# Altium schematic sheet DWS_Main_Board.SchDoc
size A3
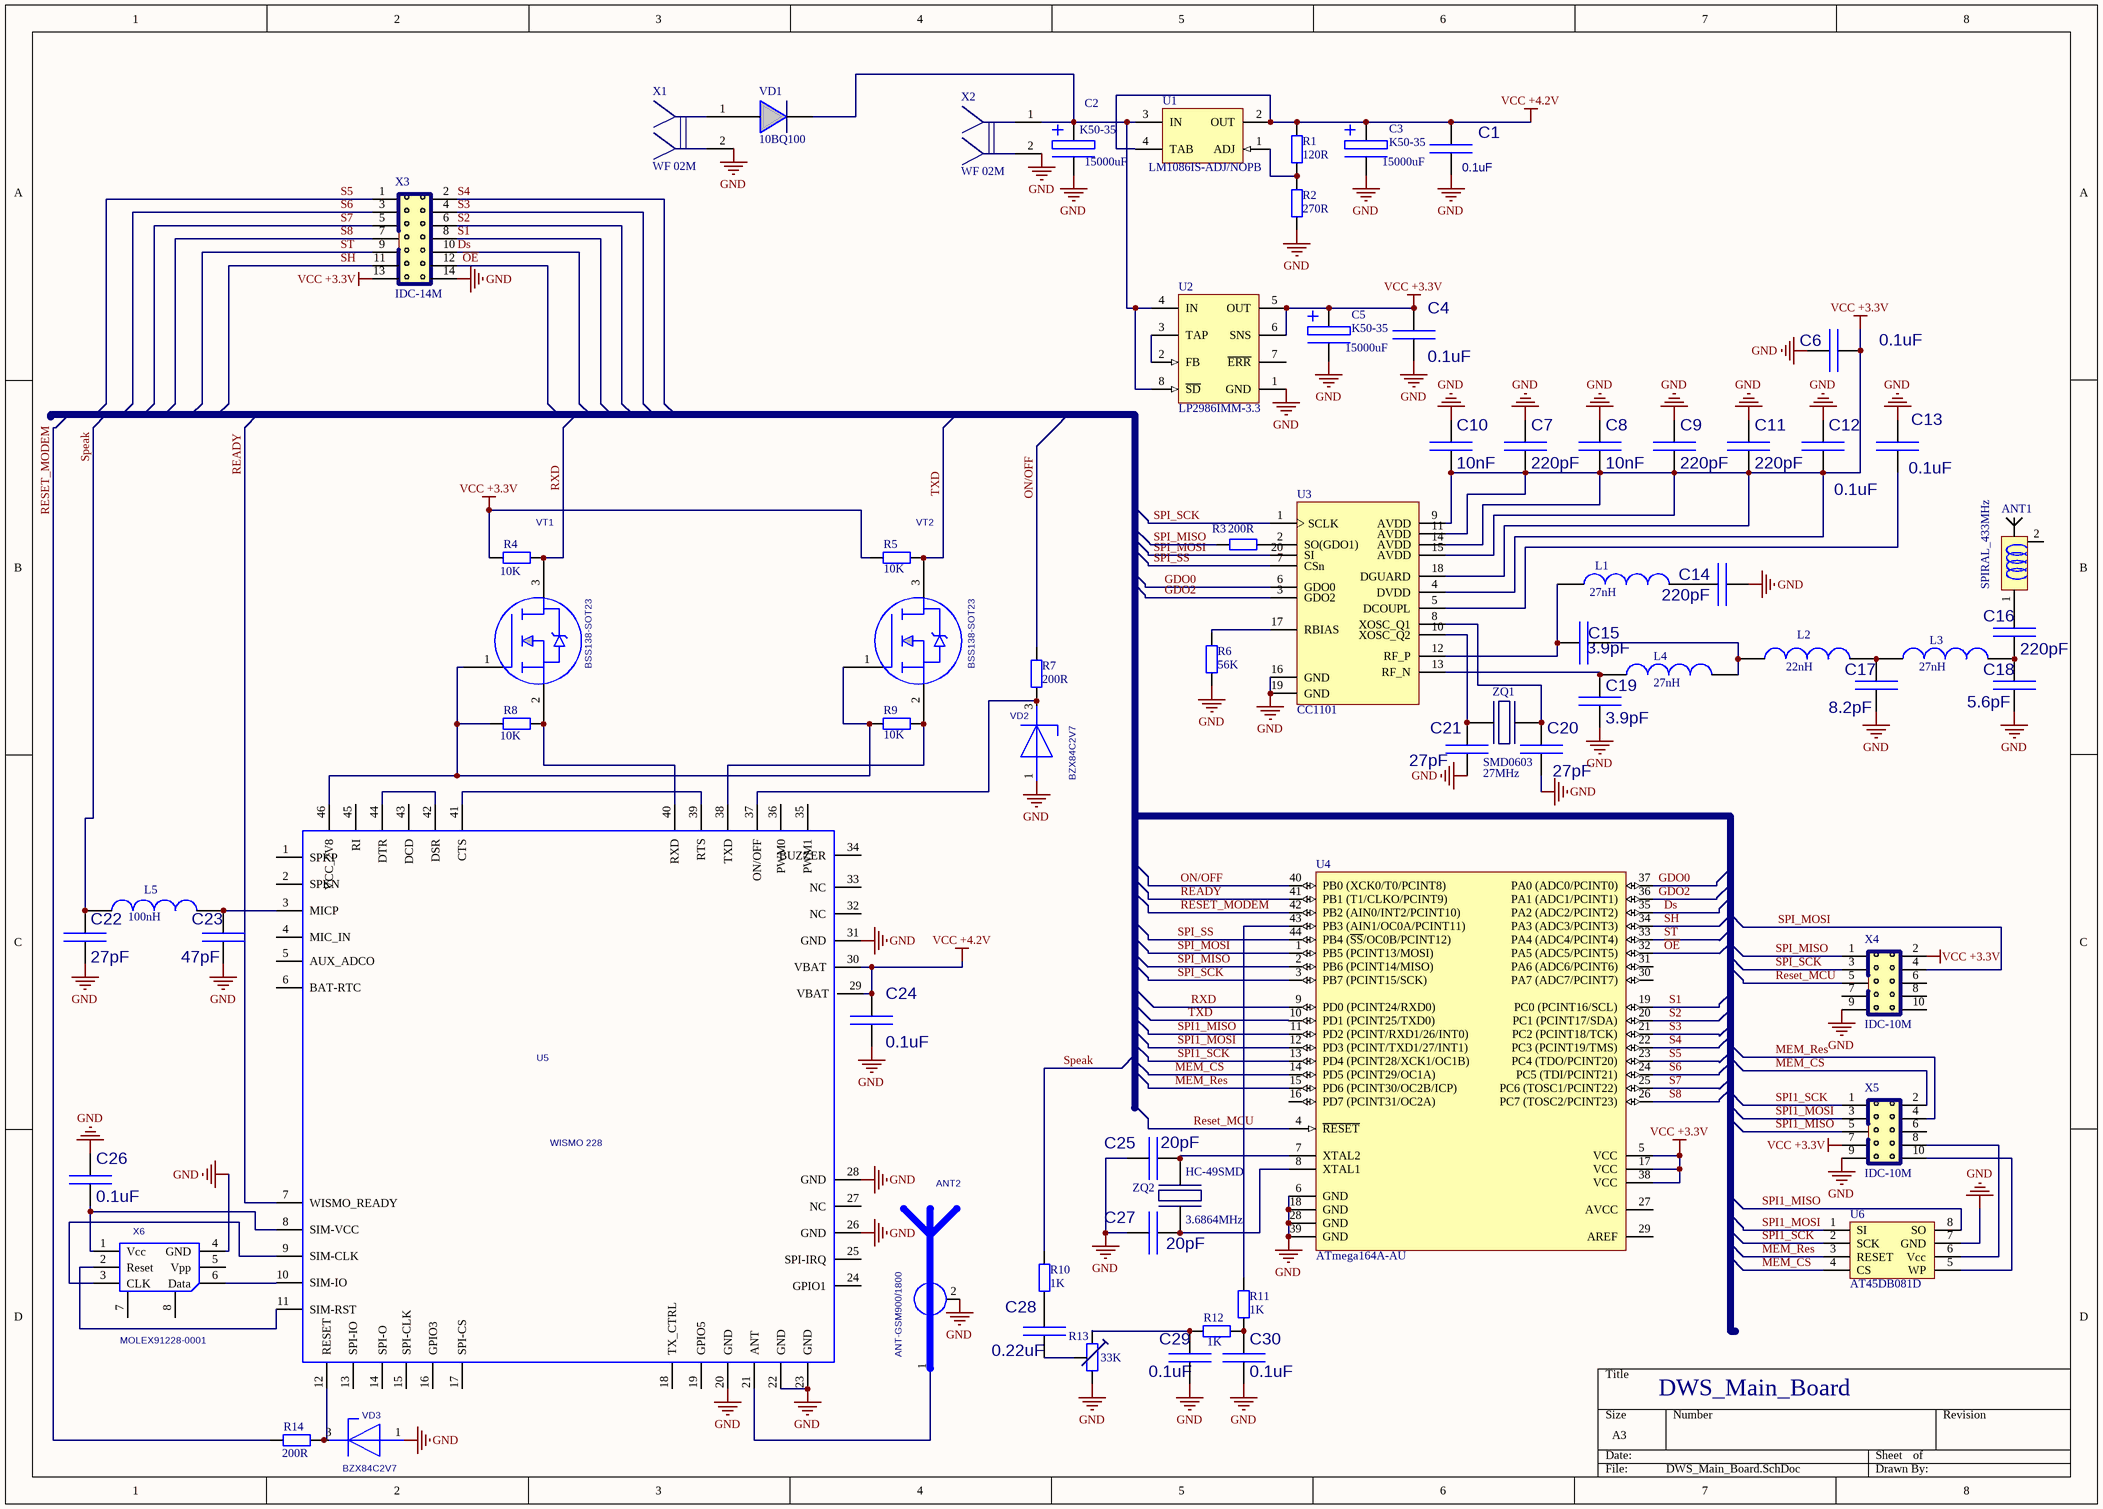
[diagram p0: DWS_Main_Board.SchDoc]

## Parts
ANT1  SPIRAL_433MHz  [ANT_433MHz_SPIRAL]
ANT2  ANT-GSM900/1800  [ANT-GSM]
C1  value 0.1uF  [C0805]  (hidden comment: KONDENS_SMD)
C2  K50-35  [CAP_POL_D18-Horizontal]
C3  K50-35  [CAP_POL_D18-Horizontal]
C4  value 0.1uF  [C0805]  (hidden comment: KONDENS_SMD)
C5  K50-35  [CAP_POL_D18-Horizontal]
C6  value 0.1uF  [C0805]  (hidden comment: KONDENS_SMD)
C7  value 220pF  [C0805]  (hidden comment: KONDENS_SMD)
C8  value 10nF  [C0805]  (hidden comment: KONDENS_SMD)
C9  value 220pF  [C0805]  (hidden comment: KONDENS_SMD)
C10  value 10nF  [C0805]  (hidden comment: KONDENS_SMD)
C11  value 220pF  [C0805]  (hidden comment: KONDENS_SMD)
C12  value 0.1uF  [C0805]  (hidden comment: KONDENS_SMD)
C13  value 0.1uF  [C0805]  (hidden comment: KONDENS_SMD)
C14  value 220pF  [C0805]  (hidden comment: KONDENS_SMD)
C15  value 3.9pF  [C0805]  (hidden comment: KONDENS_SMD)
C16  value 220pF  [C0805]  (hidden comment: KONDENS_SMD)
C17  value 8.2pF  [C0805]  (hidden comment: KONDENS_SMD)
C18  value 5.6pF  [C0805]  (hidden comment: KONDENS_SMD)
C19  value 3.9pF  [C0805]  (hidden comment: KONDENS_SMD)
C20  value 27pF  [C0805]  (hidden comment: KONDENS_SMD)
C21  value 27pF  [C0805]  (hidden comment: KONDENS_SMD)
C22  value 27pF  [C0805]  (hidden comment: KONDENS_SMD)
C23  value 47pF  [C0805]  (hidden comment: KONDENS_SMD)
C24  value 0.1uF  [C0805]  (hidden comment: KONDENS_SMD)
C25  value 20pF  [C0805]  (hidden comment: KONDENS_SMD)
C26  value 0.1uF  [C0805]  (hidden comment: KONDENS_SMD)
C27  value 20pF  [C0805]  (hidden comment: KONDENS_SMD)
C28  value 0.22uF  [C0805]  (hidden comment: KONDENS_SMD)
C29  value 0.1uF  [C0805]  (hidden comment: KONDENS_SMD)
C30  value 0.1uF  [C0805]  (hidden comment: KONDENS_SMD)
L1  value 27nH  [6-0805_M]  (hidden comment: SMD_0805)
L2  value 22nH  [6-0805_M]  (hidden comment: SMD_0805)
L3  value 27nH  [6-0805_M]  (hidden comment: SMD_0805)
L4  value 27nH  [6-0805_M]  (hidden comment: SMD_0805)
L5  value 100nH  [6-0805_M]  (hidden comment: SMD_0805)
R1  value 120R  [C0805]  (hidden comment: RES)
R2  value 270R  [C0805]  (hidden comment: RES)
R3  value 200R  [C0805]  (hidden comment: RES)
R4  value 10K  [C0805]  (hidden comment: RES)
R5  value 10K  [C0805]  (hidden comment: RES)
R6  value 56K  [C0805]  (hidden comment: RES)
R7  value 200R  [C0805]  (hidden comment: RES)
R8  value 10K  [C0805]  (hidden comment: RES)
R9  value 10K  [C0805]  (hidden comment: RES)
R10  value 1K  [C0805]  (hidden comment: RES)
R11  value 1K  [C0805]  (hidden comment: RES)
R12  value 1K  [C0805]  (hidden comment: RES)
R13  value 33K  [CA6V]  (hidden comment: CA6V)
R14  value 200R  [C0805]  (hidden comment: RES)
U1  LM1086IS-ADJ/NOPB  [TS3B_M]
U2  LP2986IMM-3.3  [MUA08A_M]
U3  CC1101  [VQFN20]
U4  ATmega164A-AU  [44A_M]
U5  WISMO 228  [WISMO]
U6  AT45DB081D  [SOIC-8]
VD1  10BQ100  [SMB]
VD2  BZX84C2V7  [SOT23]
VD3  BZX84C2V7  [SOT23]
VT1  BSS138-SOT23  [SOT23]
VT2  BSS138-SOT23  [SOT23]
X1  WF 02M  [WF 02M]
X2  WF 02M  [WF 02M]
X3  IDC-14M  [IDC-14M]
X4  IDC-10M  [IDC-10M]
X5  IDC-10M  [IDC-10M]
X6  MOLEX91228-0001  [MOLEX91228-0001]
ZQ1  SMD0603  value 27MHz  [Quartz_SMD0603]
ZQ2  HC-49SMD  value 3.6864MHz  [HC-49SMD]

## Nets
GND: ANT2.2 C1.2(B) C2.2(MINUS) C3.2(MINUS) C4.2(B) C5.2(MINUS) C6.1(A) C7.1(A) C8.1(A) C9.1(A) C10.1(A) C11.1(A) C12.1(A) C13.1(A) C14.2(B) C17.2(B) C18.2(B) C19.2(B) C20.2(B) C21.2(B) C22.2(B) C23.2(B) C24.2(B) C25.1(A) C26.1(A) C27.1(A) C29.2(B) C30.2(B) R2.1 R6.1 R13.2 U2.1(GND) U3.16(GND) U3.19(GND) U4.6(GND) U4.18(GND) U4.28(GND) U4.39(GND) U5.20(GND) U5.22(GND) U5.23(GND) U5.26(GND) U5.28(GND) U5.31(GND) U6.7(GND) VD2.1 VD3.1 X1.2 X2.2 X3.14 X4.9 X5.9 X6.4(GND)
VCC +3.3V: C4.1(A) C5.1(PLUS) C6.2(B) C7.2(B) C8.2(B) C9.2(B) C10.2(B) C11.2(B) C12.2(B) R4.1 R5.1 U2.5(OUT) U2.6(SNS) U3.4(DVDD) U3.9(AVDD) U3.11(AVDD) U3.14(AVDD) U3.15(AVDD) U3.18(DGUARD) U4.5(VCC) U4.17(VCC) U4.38(VCC) X3.13 X4.2 X5.7
VCC +4.2V: C1.1(A) C3.1(PLUS) C24.1(A) R1.2 U1.2(OUT) U1.4(TAB) U5.29(VBAT) U5.30(VBAT)
Ds: U4.35(PA2_(ADC2/PCINT2)) X3.10
GDO0: U3.6(GDO0) U4.37(PA0_(ADC0/PCINT0))
GDO2: U3.3(GDO2) U4.36(PA1_(ADC1/PCINT1))
MEM_CS: U4.14(PD5_(PCINT29/OC1A)) U6.4(CS) X5.2
MEM_Res: U4.15(PD6_(PCINT30/OC2B/ICP)) U6.3(RESET) X5.4
~{OE}: U4.32(PA5_(ADC5/PCINT5)) X3.12
ON/OFF: R7.2 U4.40(PB0_(XCK0/T0/PCINT8))
READY: U4.41(PB1_(T1/CLKO/PCINT9)) U5.7(WISMO_READY)
Reset_MCU: U4.4(~{RESET}) X4.5
RESET_MODEM: R14.1 U4.42(PB2_(AIN0/INT2/PCINT10))
RXD: R4.2 U4.9(PD0_(PCINT24/RXD0)) VT1.3(Drain)
S1: U4.19(PC0_(PCINT16/SCL)) X3.8
S2: U4.20(PC1_(PCINT17/SDA)) X3.6
S3: U4.21(PC2_(PCINT18/TCK)) X3.4
S4: U4.22(PC3_(PCINT19/TMS)) X3.2
S5: U4.23(PC4_(TDO/PCINT20)) X3.1
S6: U4.24(PC5_(TDI/PCINT21)) X3.3
S7: U4.25(PC6_(TOSC1/PCINT22)) X3.5
S8: U4.26(PC7_(TOSC2/PCINT23)) X3.7
SH: U4.34(PA3_(ADC3/PCINT3)) X3.11
Speak: C22.1(A) L5.1 R10.2
SPI1_MISO: U4.11(PD2_(PCINT/RXD1/26/INT0)) U6.8(SO) X5.5
SPI1_MOSI: U4.12(PD3_(PCINT/TXD1/27/INT1)) U6.1(SI) X5.3
SPI1_SCK: U4.13(PD4_(PCINT28/XCK1/OC1B)) U6.2(SCK) X5.1
SPI_MISO: R3.1 U4.2(PB6_(PCINT14/MISO)) X4.1
SPI_MOSI: U3.20(SI) U4.1(PB5_(PCINT13/MOSI)) X4.4
SPI_SCK: U3.1(SCLK) U4.3(PB7_(PCINT15/SCK)) X4.3
SPI_SS: U3.7(CSn) U4.44(PB4_(~{SS}/OC0B/PCINT12))
ST: U4.33(PA4_(ADC4/PCINT4)) X3.9
TXD: R5.2 U4.10(PD1_(PCINT25/TXD0)) VT2.3(Drain)
NetANT1_1: ANT1.1 C16.1(A)
NetANT2_1: ANT2.1 U5.21(ANT)
NetC2_1: C2.1(PLUS) U1.3(IN) U2.4(IN) U2.8(~{SD}) VD1.1 X2.1
NetC13_2: C13.2(B) U3.5(DCOUPL)
NetC14_1: C14.1(A) L1.2
NetC15_1: C15.1(A) L1.1 U3.12(RF_P)
NetC15_2: C15.2(B) L2.1 L4.2
NetC16_2: C16.2(B) C18.1(A) L3.2
NetC17_1: C17.1(A) L2.2 L3.1
NetC19_1: C19.1(A) L4.1 U3.13(RF_N)
NetC20_1: C20.1(A) U3.8(XOSC_Q1) ZQ1.1
NetC21_1: C21.1(A) U3.10(XOSC_Q2) ZQ1.3
NetC23_1: C23.1(A) L5.2 U5.3(MICP)
NetC25_2: C25.2(B) U4.7(XTAL2) ZQ2.1
NetC26_2: C26.2(B) U5.8(SIM-VCC) X6.1(Vcc)
NetC27_2: C27.2(B) U4.8(XTAL1) ZQ2.2
NetC28_1: C28.1(A) R10.1
NetC28_2: C28.2(B) R13.3
NetC29_1: C29.1(A) R12.2 R13.1
NetC30_1: C30.1(A) R11.1 R12.1
NetR1_1: R1.1 R2.2 U1.1(ADJ)
NetR3_2: R3.2 U3.2(SO(GDO1))
NetR6_2: R6.2 U3.17(RBIAS)
NetR7_1: R7.1 U5.37(ON/OFF) VD2.3
NetR8_1: R8.1 R9.1 U5.46(VCC_2V8) VT1.1(Gate) VT2.1(Gate)
NetR8_2: R8.2 U5.40(RXD) VT1.2(Source)
NetR9_2: R9.2 U5.38(TXD) VT2.2(Source)
NetR11_2: R11.2 U4.43(PB3_(AIN1/OC0A/PCINT11))
NetR14_2: R14.2 U5.12(RESET) VD3.3
NetU2_2: U2.2(FB) U2.3(TAP)
NetU5_9: U5.9(SIM-CLK) X6.3(CLK)
NetU5_10: U5.10(SIM-IO) X6.6(Data)
NetU5_11: U5.11(SIM-RST) X6.2(Reset)
NetU5_39: U5.39(RTS) U5.41(CTS)
NetU5_42: U5.42(DSR) U5.44(DTR)
NetU6_5: U6.5(WP) X5.10
NetU6_6: U6.6(Vcc) X5.8
NetVD1_2: VD1.2 X1.1

Not connected (* = marked no-connect by the designer): ANT1 2; U2 7(~{ERR}); U4 16(PD7_(PCINT31/OC2A)) 27(AVCC) 29(AREF) 30(PA7_(ADC7/PCINT7)) 31(PA6_(ADC6/PCINT6)); U5 1(SPKP) 2(SPKN) 4(MIC_IN) 5(AUX_ADCO) 6(BAT-RTC) 13(SPI-IO) 14(SPI-O) 15(SPI-CLK) 16(GPIO3) 17(SPI-CS) 18(TX_CTRL) 19(GPIO5) 24(GPIO1) 25(SPI-IRQ) 27(NC) 32(NC) 33(NC) 34(BUZZER) 35(PWM1) 36(PWM0) 43(DCD) 45(RI); VD2 2; VD3 2; X4 6 7 8 10; X5 6; X6 5(Vpp) 7(0) 8(1)

## Notes on the sheet
- DWS_Main_Board
- (in symbol Capasitor _pol D18) 15000uF

## Library data of the parts
ANT1 = ANT_433MHz_SPIRAL
C2 C3 C5 = Capasitor _pol D18
L1-L5 = Induktor_0805
R1-R12 R14 = RES: Resistor
R13 = Resistor_podstr
U1 = LM1086IS-ADJ/NOPB: 1.5A Low Dropout Positive Regulators, 3-pin TO-263, Pb-Free; Manufacturer: National Semiconductor; PackageTopMarking: NSUZXYTTE#*LM1086*IS-ADJ; PowerWise: N; CompType: LDO IC; Published: 1-Mar-2010; DatasheetVersion: Jun-2005; PackageVersion: revF, Apr-2005; PackageReference: TS3B; Publisher: Altium Limited; PackageDescription: TO-263, Molded, .400 x .390 x .180in, 3 Lead, .1in Pitch, Surface Mount; Supplier 1: Digi-Key; Supplier Part Number 1: LM1086IS-ADJ-ND; Supplier 2: Farnell; Supplier Part Number 2: 1469045; PartNumber: LM1086IS-ADJ/NOPB; RoHS: Y; PinCount: 3; Code_JEDEC: MO-169-AA; ComponentLink1Description: LM1086 Datasheet; ComponentLink1URL: http://www.national.com/ds/LM/LM1086.pdf; ComponentLink2Description: LM1086 Web Page; ComponentLink2URL: http://www.national.com/pf/LM/LM1086.html; ComponentLink3Description: TS3B Package Page; ComponentLink3URL: http://www.national.com/packaging/folders/ts3b.html
U2 = LP2986IMM-3.3: Micropower, 200 mA Ultra Low-Dropout Fixed or Adjustable Voltage Regulator, 8-pin Mini SOIC; Manufacturer: National Semiconductor; PackageTopMarking: ZXTT*L40B; PowerWise: N; CompType: LDO IC; Published: 4-Dec-2008; DatasheetVersion: Mar-2005; PackageVersion: revF, Apr-2008; PackageReference: MUA08A; Publisher: Altium Limited; PackageDescription: MINI SOIC, .118 x .118 x .034in, 8 Lead, .0256in Pitch; Supplier 1: Farnell; Supplier Part Number 1: 956338; PartNumber: LP2986IMM-3.3; RoHS: N; PinCount: 8; Code_JEDEC: MO-187-AA; ComponentLink1Description: LP2986 Datasheet; ComponentLink1URL: http://www.national.com/ds/LP/LP2986.pdf; ComponentLink2Description: LP2986 Web Page; ComponentLink2URL: http://www.national.com/pf/LP/LP2986.html; ComponentLink3Description: MUA08A Package Page; ComponentLink3URL: http://www.national.com/packaging/folders/mua08a.html
U4 = ATmega164A-AU: 8-bit AVR Microcontroller, 16KB Flash, 512 Bytes EEPROM, 1KB SRAM, 44-pin TQFP, Industrial Grade (-40°C to 85°C); Published: 1-Apr-2010; DatasheetVersion: revA, Jan-2010; PackageVersion: rev.B, Oct-2001; PackageReference: 44A; Publisher: Altium Limited; PackageDescription: 44-Pin Plastic Thin Profile Quad Flat Pack, 10 x 10 x 1.0 mm Body, 0.8 mm Pitch (TQFP); Supplier 1: Digi-Key; Supplier Part Number 1: ATMEGA164A-AU-ND; Supplier 2: Mouser; Supplier Part Number 2: 556-ATMEGA164A-AU; ComponentLink1Description: Manufacturer Link; ComponentLink1URL: http://www.atmel.com/products/avr/default.asp?; ComponentLink2Description: ATmega164A/164PA/324A/324PA/644A/644PA/1284/1284P Datasheet; ComponentLink2URL: http://www.atmel.com/dyn/resources/prod_documents/doc8272.pdf; ComponentLink3Description: ATmega164A/164PA/324A/324PA/644A/644PA/1284/1284P Summary; ComponentLink3URL: http://www.atmel.com/dyn/resources/prod_documents/8272S.pdf; ComponentLink4Description: Atmel.com Home; ComponentLink4URL: http://www.atmel.com
ZQ1 = Quartz_SMD0603
ANT2 = ANT-GSM900/1800: Value: *
U5 = WISMO 228: Value: *
VD2 VD3 = BZX84C2V7: Value: *
VT1 VT2 = BSS138-SOT23: Value: *
X6 = MOLEX91228-0001: Value: *